# Altium project wch554g.PrjPcb
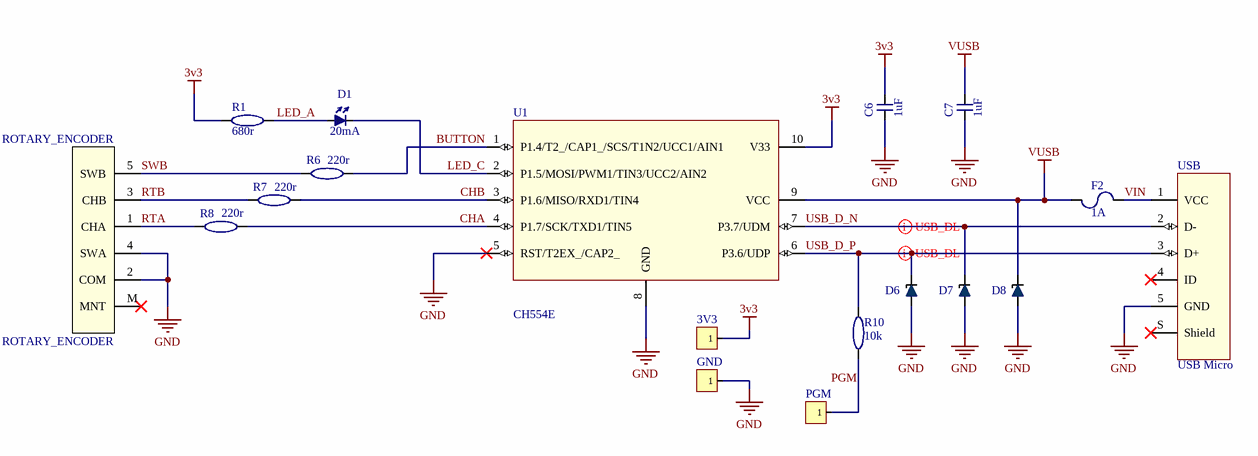
[diagram p0: wch554g.SchDoc]
VERSION: 2
1 sheet, 18 parts. Net scope: global (net labels, ports and power ports of the same name join across sheets).
Board files: wch554g.PcbDoc, ch554_panel.PcbDoc

## Sheet wch554g.SchDoc: Knob CH554G V2
size 290 x 209 mm; Author: skilbeck.com; Revision: 1; SheetNumber: 1; SheetTotal: 1

### Parts
3V3  CON2  [CON2]  (value not drawn)  (no BOM)
C6  1uF  [MLCC_0603]
C7  1uF  [MLCC_0603]
D1  20mA  [SMT_LED_0603]
D6  TVS_DIODE  [TVS_DIODE]  (value not drawn)
D7  TVS_DIODE  [TVS_DIODE]  (value not drawn)
D8  TVS_DIODE  [TVS_DIODE]  (value not drawn)
F2  1A  [FUSE 0603]
GND  CON2  [CON2]  (value not drawn)  (no BOM)
PGM  CON2  [CON2]  (value not drawn)  (no BOM)
R1  680r  [SMT_RES_0603]
R6  220r  [SMT_RES_0603]
R7  220r  [SMT_RES_0603]
R8  220r  [SMT_RES_0603]
R10  10k  [SMT_RES_0603]
ROTARY_ENCODER  ROTARY_ENCODER  [ENCODER]  (no BOM)
U1  CH554E  [MSOP10]
USB  USB Micro  [USB MICRO B]

### Nets
3v3: 3V3.1 C6.2(B) R1.1(A) U1.10(V33)
GND: C6.1(A) C7.1(A) D6.2(A) D7.2(A) D8.2(A) GND.1 ROTARY_ENCODER.2(COM) ROTARY_ENCODER.4(SWA) U1.5(RST/T2EX_/CAP2_) U1.8(GND) USB.5(GND)
VUSB: C7.2(B) D8.1(K) F2.2 U1.9(VCC)
BUTTON: R6.2(B) U1.1(P1.4/T2_/CAP1_/SCS/T1N2/UCC1/AIN1)
CHA: R8.2(B) U1.4(P1.7/SCK/TXD1/TIN5)
CHB: R7.2(B) U1.3(P1.6/MISO/RXD1/TIN4)
LED_A: D1.2(A) R1.2(B)
LED_C: D1.1(K) U1.2(P1.5/MOSI/PWM1/TIN3/UCC2/AIN2)
PGM: PGM.1 R10.1(A)
RTA: R8.1(A) ROTARY_ENCODER.1(CHA)
RTB: R7.1(A) ROTARY_ENCODER.3(CHB)
SWB: R6.1(A) ROTARY_ENCODER.5(SWB)
USB_D_N: D7.1(K) U1.7(P3.7/UDM) USB.2(D-)
USB_D_P: D6.1(K) R10.2(B) U1.6(P3.6/UDP) USB.3(D+)
VIN: F2.1 USB.1(VCC)

Not connected (* = marked no-connect by the designer): ROTARY_ENCODER M(MNT)*; USB 4(ID)* S(Shield)*

### Layout directives
differential pair: USB_D_N, USB_D_P

### Library data of the parts
C6 C7 = CAP_CERAMIC: MLCC; Value: 1uF; Package: *; JLCPCB Part #: C29936
D1 = LED: Value: 20mA; JLCPCB Part #: C205445
D6-D8 = TVS_DIODE: TVS Diode; JLCPCB Part #: C151980
F2 = FUSE: Resettable fuse; JLCPCB Part #: C210357; Value: 1A
R1 R6-R8 R10 = RESISTOR
  R1: Value: 680r; JLCPCB Part #: C23228
  R6-R8: Value: 220r; JLCPCB Part #: C27592
  R10: Value: 10k; JLCPCB Part #: C25804
ROTARY_ENCODER = ROTARY_ENCODER: Rotary Encoder
USB = USB_SOCKET: USB Receptacle; JLCPCB Part #: C397452
U1 = CH554E: JLCPCB Part #: C111293